# Altium project FMC_SDR_LFFE.PrjPcb (part 1 of 3)
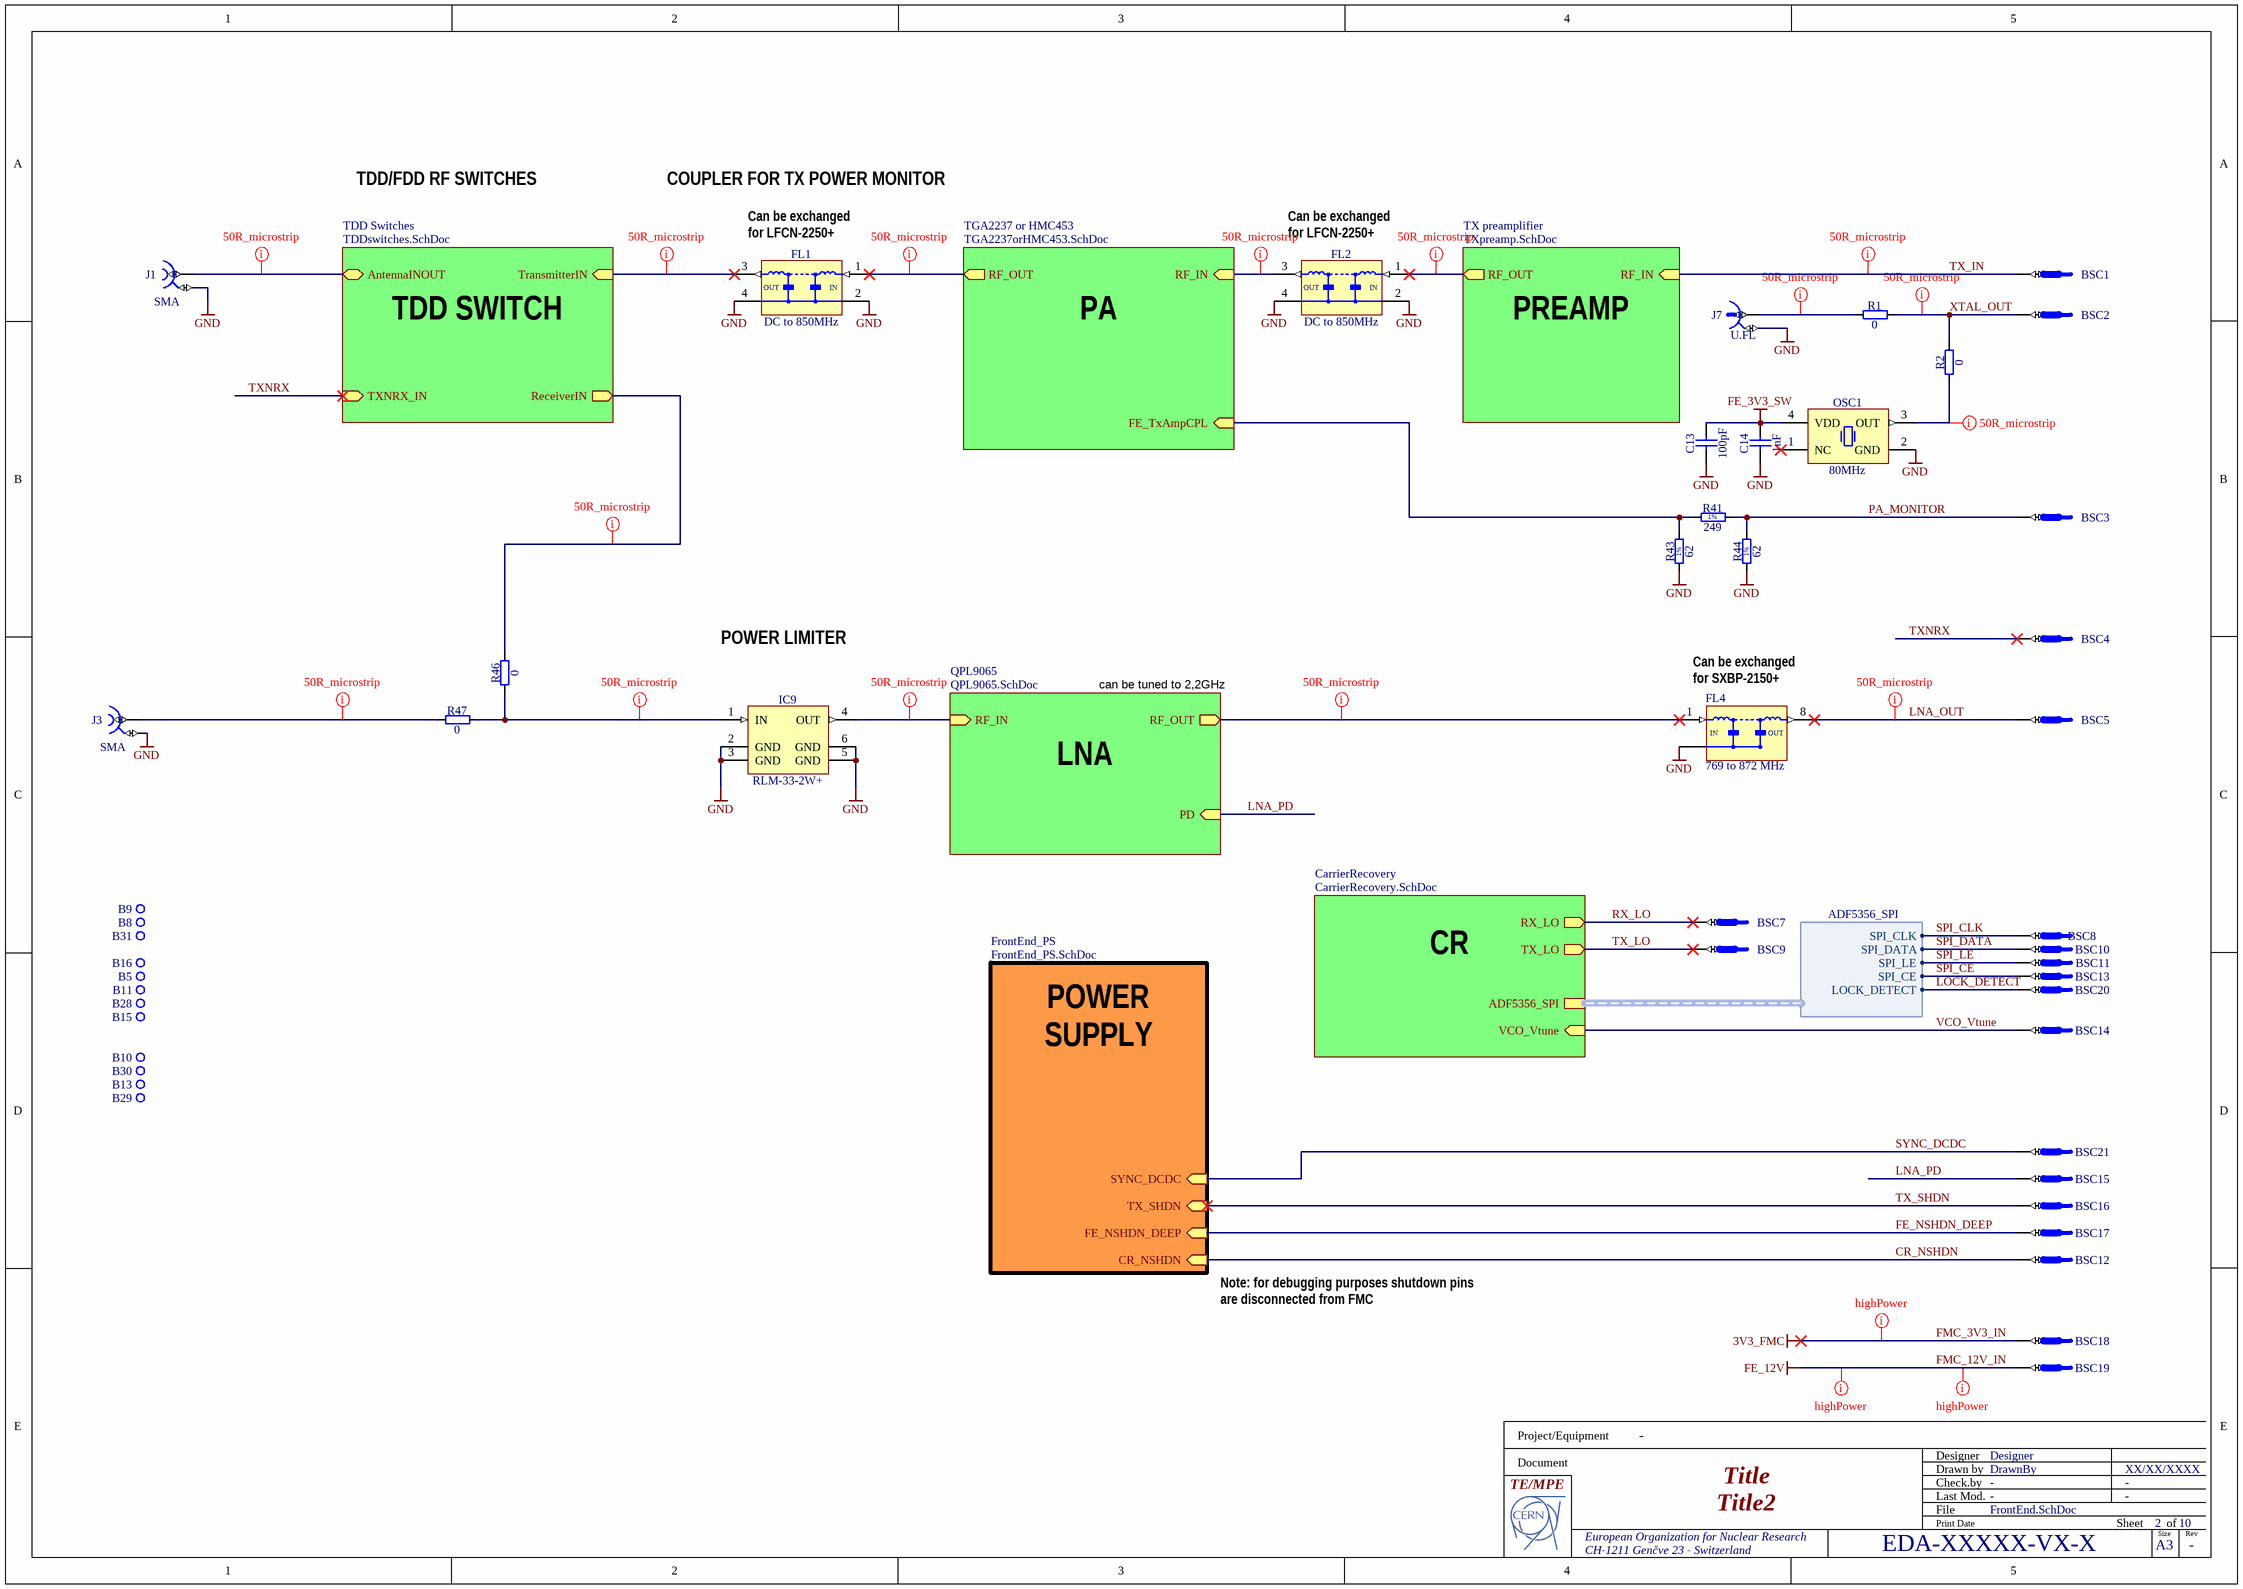
[diagram p0: FrontEnd.SchDoc]
10 sheets, 325 parts. Net scope: hierarchical (ports join the sheet entries above them; power ports are global).
Board file: FMC_SDR_LFFE.PcbDoc
Sheets:
  FrontEnd.SchDoc
    FrontEnd_PS = FrontEnd_PS.SchDoc
      BUCK1 = LTM8032_5V5.SchDoc
      BUCK2 = LTM8032_3V8.SchDoc
      BUCKBOOST = LTM8056.SchDoc
    QPL9065 = QPL9065.SchDoc
    TGA2237 or HMC453 = TGA2237orHMC453.SchDoc
    TX preamplifier = TXpreamp.SchDoc
    TDD Switches = TDDswitches.SchDoc
    CarrierRecovery = CarrierRecovery.SchDoc

## Sheet FrontEnd.SchDoc: Title
size 420 x 297 mm; CheckedBy: -; CompanyName: CERN; DrawnBy: DrawnBy; Organization: CERN; Address1: European Organization for Nuclear Research; Address2: CH-1211 Genčve 23 - Switzerland; DocumentNumber: 2; Revision: -; SheetNumber: 2; SheetTotal: 10; EDA_Number: EDA-XXXXX-VX-X; Projet: -; ModifiedBy: -; CreateDate: XX/XX/XXXX; CheckedDate: -; Title2: Title2; DivGrp: TE/MPE; Designer: Designer; ModifiedDate: -

### Parts
B5  Plated Hole  [MTG240_400]  (value not drawn)  (no BOM)
B8  Plated Hole  [MTG240_400]  (value not drawn)  (no BOM)
B9  Plated Hole  [MTG240_400]  (value not drawn)  (no BOM)
B10  Plated Hole  [MTG240_400]  (value not drawn)  (no BOM)
B11  Plated Hole  [MTG240_400]  (value not drawn)  (no BOM)
B13  Plated Hole  [MTG240_400]  (value not drawn)  (no BOM)
B15  Plated Hole  [MTG240_400]  (value not drawn)  (no BOM)
B16  Plated Hole  [MTG240_400]  (value not drawn)  (no BOM)
B28  Plated Hole  [MTG240_400]  (value not drawn)  (no BOM)
B29  Plated Hole  [MTG240_400]  (value not drawn)  (no BOM)
B30  Plated Hole  [MTG240_400]  (value not drawn)  (no BOM)
B31  Plated Hole  [MTG240_400]  (value not drawn)  (no BOM)
BSC1  06031206 Male  [PCB_CONN_0603M]  (value not drawn)
BSC2  06031206 Male  [PCB_CONN_0603M]  (value not drawn)
BSC3  06031206 Male  [PCB_CONN_0603M]  (value not drawn)
BSC4  06031206 Male  [PCB_CONN_0603M]  (value not drawn)
BSC5  06031206 Male  [PCB_CONN_0603M]  (value not drawn)
BSC7  06031206 Male  [PCB_CONN_0603M]  (value not drawn)
BSC8  06031206 Male  [PCB_CONN_0603M]  (value not drawn)
BSC9  06031206 Male  [PCB_CONN_0603M]  (value not drawn)
BSC10  06031206 Male  [PCB_CONN_0603M]  (value not drawn)
BSC11  06031206 Male  [PCB_CONN_0603M]  (value not drawn)
BSC12  06031206 Male  [PCB_CONN_0603M]  (value not drawn)
BSC13  06031206 Male  [PCB_CONN_0603M]  (value not drawn)
BSC14  06031206 Male  [PCB_CONN_0603M]  (value not drawn)
BSC15  06031206 Male  [PCB_CONN_0603M]  (value not drawn)
BSC16  06031206 Male  [PCB_CONN_0603M]  (value not drawn)
BSC17  06031206 Male  [PCB_CONN_0603M]  (value not drawn)
BSC18  1206 Male  [PCB_CONN_1206M]  (value not drawn)
BSC19  1206 Male  [PCB_CONN_1206M]  (value not drawn)
BSC20  06031206 Male  [PCB_CONN_0603M]  (value not drawn)
BSC21  06031206 Male  [PCB_CONN_0603M]  (value not drawn)
C13  100pF  [CAPC1005X55N]
C14  1nF  [CAPC1005X55N]
FL1  DC to 850MHz  [FIL_MINI-CIRCUITS_FV1206]
FL2  DC to 850MHz  [FIL_MINI-CIRCUITS_FV1206]
FL4  769 to 872 MHz  [SXBP-820+]
IC9  RLM-33-2W+  [MINI-CIRCUITS_TT1224]
J1  SMA  [TELEGARTNER_J01151A0451]
J3  SMA  [TELEGARTNER_J01151A0451]
J7  U.FL  [HIROSE_U.FL-R-SMT-1(10)]
OSC1  80MHz  [OSC_CRYSTEK_CCHD-575]
R1  0  [RESC1005X40N]
R2  0  [RESC1005X40N]
R41  249  [RESC1005X40N]
R43  62  [RESC1005X40N]
R44  62  [RESC1005X40N]
R46  0  [RESC1005X40N]
R47  0  [RESC1005X40N]

### Sub-sheets
CarrierRecovery = CarrierRecovery.SchDoc: RX_LO (out), TX_LO (out), ADF5356_SPI (harness ADF5356_SPI), VCO_Vtune (in)
FrontEnd_PS = FrontEnd_PS.SchDoc: TX_SHDN (in), FE_NSHDN_DEEP (in), CR_NSHDN (in), SYNC_DCDC (in)
QPL9065 = QPL9065.SchDoc: RF_OUT (out), RF_IN (in), PD (in)
TDD Switches = TDDswitches.SchDoc: AntennaINOUT (bidir), TransmitterIN (in), TXNRX_IN (in), ReceiverIN (out)
TGA2237 or HMC453 = TGA2237orHMC453.SchDoc: RF_OUT (out), RF_IN (in), FE_TxAmpCPL (in)
TX preamplifier = TXpreamp.SchDoc: RF_OUT (out), RF_IN (in)

### Harnesses
ADF5356_SPI: SPI_CLK, SPI_DATA, SPI_LE, SPI_CE, LOCK_DETECT

### Nets
FE_3V3_SW: C13.2 C14.2 OSC1.4(VDD)
FMC_3V3_IN: BSC18.1  [also labelled 3V3_FMC]
FMC_12V_IN: BSC19.1  [also labelled FE_12V]
GND: C13.1 C14.1 FL1.2(GND) FL1.4(GND) FL2.2(GND) FL2.4(GND) FL4.2,3,4,5,6,7(GND) IC9.2(GND) IC9.3(GND) IC9.5(GND) IC9.6(GND) J1.2 J3.2 J7.2 OSC1.2(GND) R43.1 R44.1
CR_NSHDN: BSC12.1 ; sheet FrontEnd_PS/CR_NSHDN
FE_NSHDN_DEEP: BSC17.1 ; sheet FrontEnd_PS/FE_NSHDN_DEEP
FE_TxAmpCPL: R41.1 R43.2 ; sheet TGA2237 or HMC453/FE_TxAmpCPL
LNA_OUT: BSC5.1 FL4.8(RFOUT)
LNA_PD: BSC15.1 ; sheet QPL9065/PD
LOCK_DETECT: BSC20.1 ; sheet CarrierRecovery/ADF5356_SPI.LOCK_DETECT
PA_MONITOR: BSC3.1 R41.2 R44.2
RX_LO: BSC7.1 ; sheet CarrierRecovery/RX_LO
SPI_CE: BSC13.1 ; sheet CarrierRecovery/ADF5356_SPI.SPI_CE  [project net 5356_SPI_CE]
SPI_CLK: BSC8.1 ; sheet CarrierRecovery/ADF5356_SPI.SPI_CLK  [project net 5356_SPI_CLK]
SPI_DATA: BSC10.1 ; sheet CarrierRecovery/ADF5356_SPI.SPI_DATA  [project net 5356_SPI_DATA]
SPI_LE: BSC11.1 ; sheet CarrierRecovery/ADF5356_SPI.SPI_LE  [project net 5356_SPI_LE]
SYNC_DCDC: BSC21.1 ; sheet FrontEnd_PS/SYNC_DCDC
TX_IN: BSC1.1 ; sheet TX preamplifier/RF_IN
TX_LO: BSC9.1 ; sheet CarrierRecovery/TX_LO
TX_SHDN: BSC16.1 ; sheet FrontEnd_PS/TX_SHDN
TXNRX: BSC4.1 ; sheet TDD Switches/TXNRX_IN
VCO_Vtune: BSC14.1 ; sheet CarrierRecovery/VCO_Vtune
XTAL_OUT: BSC2.1 R1.2 R2.2
NetC16_1: FL2.3(RFOUT) ; sheet TGA2237 or HMC453/RF_IN
NetC156_1: J1.1 ; sheet TDD Switches/AntennaINOUT
NetC157_2: FL1.3(RFOUT) ; sheet TDD Switches/TransmitterIN
NetC158_2: R46.2 ; sheet TDD Switches/ReceiverIN
NetC178_2: FL2.1(RFIN) ; sheet TX preamplifier/RF_OUT
NetFL1_1: FL1.1(RFIN) ; sheet TGA2237 or HMC453/RF_OUT
NetFL4_1: FL4.1(RFIN) ; sheet QPL9065/RF_OUT
NetIC9_1: IC9.1(IN) R46.1 R47.2
NetIC9_4: IC9.4(OUT) ; sheet QPL9065/RF_IN
NetJ3_1: J3.1 R47.1
NetJ7_1: J7.1 R1.1
NetOSC1_3: OSC1.3(OUT) R2.1

Not connected (* = marked no-connect by the designer): B5 1; B8 1; B9 1; B10 1; B11 1; B13 1; B15 1; B16 1; B28 1; B29 1; B30 1; B31 1; OSC1 1(NC)*

### Layout directives
net class 50R_class: LNA_OUT, NetC16_1, NetC156_1, NetC157_2, NetC158_2, NetC178_2, NetFL1_1, NetFL4_1, NetIC9_1, NetIC9_4, NetJ3_1, NetJ7_1, NetOSC1_3, TX_IN, XTAL_OUT
net class highPower: FMC_3V3_IN, FMC_12V_IN

### Notes on the sheet
- TDD/FDD RF SWITCHES
- COUPLER FOR TX POWER MONITOR
- (near FL1) Can be exchanged for LFCN-2250+
- (near FL2) Can be exchanged for LFCN-2250+
- TDD SWITCH
- PA
- PREAMP
- (near R41) -20dB
- POWER LIMITER
- can be tuned to 2,2GHz
- (near FL4) Can be exchanged for SXBP-2150+
- LNA
- CR
- POWER
  SUPPLY
- Note: for debugging purposes shutdown pins are disconnected from FMC
- Project/Equipment
- Document
- Designer
- Drawn by
- Check.by
- File
- Last Mod.
- Print Date
- Sheet
- Size
- A3
- of
- Rev
- (in symbol LFCN-900+) OUT; IN
- (in symbol R0402_62R_1%_0.0625W_100PPM) 1%
- (in symbol R0402_249R_1%_0.0625W_100PPM) 1%
- (in symbol SXBP-820+) IN; OUT

### Library data of the parts
B5 B8-B11 B13 B15 B16 B28-B31 = PLATED_HOLE2.4_PAD4.0: Single Terminal Socket; Part Description: Plated Through Hole: Hole Dia.=2.4mm Pad Dia.=4.0mm; Mounted: No; Table: Pads; Part Number: PLATED_HOLE2.4_PAD4.0; Component Type: Standard (No BOM); Pin Count: 1; Family: Plated Hole; Socket: No; SMD: No; Status: None; ComponentHeight: 0mm; Author: CERN DEM JMW; CreateDate: 2011-10-10; LatestRevisionDate: 2011-10-10; PackageDescription: Plated Through Hole: Hole Dia.=2.4mm Pad Dia.=4.0mm
BSC1-BSC5 BSC7-BSC17 BSC20 BSC21 = 0603_male_BoardSolderConnector: Part Description: Board connection - soldered 0603 jumper; PressFit: No; Pin Count: 1; Socket: No; SMD: Yes; Sense: No; Status: None; System: Connector
BSC18 BSC19 = 1206_male_BoardSolderConnector: Part Description: Board connection - soldered 1206 jumper; PressFit: No; Pin Count: 1; Socket: No; SMD: Yes; Sense: No; Status: None; System: Connector
C13 = CC0402_100PF_50V_5%_C0G: Non-polarised capacitor; Part Description: SMD Multilayer Chip Ceramic Capacitor; Manufacturer: GENERIC; Manufacturer1 Part Number: C0402C101J5GACTU; Voltage: 50V; TC: C0G/NP0; Tolerance: ±5%; Part Number: CC0402_100PF_50V_5%_C0G; Component Kind: Standard; Component Type: Standard; Pin Count: 2; Value: 100pF; Status: Preferred; Manufacturer Part Number: CC0402_100PF_50V_5%_C0G; Case: 0402; Mounted: Yes; Socket: No; SMD: Yes; Sense: No; Manufacturer1 Example: KEMET; Manufacturer1 ComponentHeight: 0.55mm; HelpURL: \\cern.ch\dfs\Applications\Altium\Datasheets\CC0805_C0G_KEMET_(Commercial Grade).pdf; Author: CERN DEM JLC; CreateDate: 03.12.2007; LatestRevisionDate: 22.04.2015
C14 = CC0402_1NF_50V_10%_X7R: Non-polarised capacitor; Part Description: SMD Multilayer Chip Ceramic Capacitor; Manufacturer: GENERIC; Manufacturer1 Part Number: 223858715623; Voltage: 50V; TC: X7R; Tolerance: ±10%; Part Number: CC0402_1NF_50V_10%_X7R; Component Kind: Standard; Component Type: Standard; Pin Count: 2; Value: 1nF; Status: Not Recommended; Manufacturer Part Number: CC0402_1NF_50V_10%_X7R; Case: 0402; Mounted: Yes; Socket: No; SMD: Yes; Sense: No; Manufacturer1 Example: PHYCOMP; Manufacturer1 ComponentHeight: 0.55mm; HelpURL: \\cern.ch\dfs\Applications\Altium\Datasheets\CC0402_X7R_PHYCOMP.pdf; Author: CERN DEM JLC; CreateDate: 03.12.2007; LatestRevisionDate: 03.12.2007
FL1 FL2 = LFCN-900+: LTCC Low Pass Filter, DC -850 MHz; Part Number: FIL_MINI-CIRCUITS_LFCN-1575+; Part Description: 50 Ohm Low Pass Filter; Manufacturer: MINI-CIRCUITS; Manufacturer Part Number: LFCN-1575+; Value: DC to 1575MHz; Component Kind: Standard; Component Type: Standard; Pin Count: 2; Status: None; Mounted: Yes; Socket: No; SMD: Yes; Sense: No; ComponentHeight: 0.94mm; HelpURL: \\cern.ch\dfs\Applications\Altium\Datasheets\FIL_MINI-CIRCUITS_LFCN-1575+.pdf; Author: CERN DEM JLC; CreateDate: 21.04.2014; LatestRevisionDate: 21.04.2015
FL4 = SXBP-820+
IC9 = RLM-33-2W+: 50 Ohm, 0.2 to 3000MHz, +12 to +33dBm Limiter; Part Description: 50 Ohms, 0.2 to 3000MHz, +12 to +33dBm Limiter; Manufacturer: MINI-CIRCUITS; PressFit: No; Bonding: No; Part Number: RLM-33-2W+; Component Kind: Standard; Component Type: Standard; Device: RLM-33-2W+; PackageDescription: MINI-CIRCUITS TT1224 Case, 6 pin, 6.35mm W X 7.87mm L; Manufacturer Part Number: RLM-33-2W+; Pin Count: 6; Mounted: Yes; Socket: No; SMD: Yes; Sense: No; ComponentHeight: 4.06mm; Author: CERN DEM JLC; HelpURL: \\cern.ch\dfs\Applications\Altium\Datasheets\RLM-33-2W+.pdf; CreateDate: 11.09.2013; LatestRevisionDate: 11.09.2013
J1 J3 = TELEGARTNER_J01151A0451: Part Description: SMA 50 ohms Edge Mount Bulkhead Jack Receptacle; PressFit: No; Part Number: TELEGARTNER_J01151A0451; Component Kind: Standard; Component Type: Standard; Pin Count: 2; Family: SMA; Mounted: Yes; Socket: No; SMD: No; Sense: No; Status: None; Manufacturer: TELEGARTNER; Manufacturer Part Number: J01151A0451; ComponentHeight: 7mm; HelpURL: \\cern.ch\dfs\Applications\Altium\Datasheets\TELEGARTNER_J01151A0451.pdf; Author: CERN DEM JLC; CreateDate: 27/10/2016; LatestRevisionDate: 27/10/2016
J7 = HIROSE_U.FL-R-SMT-1(10): Part Description: Up to 6GHz Ultra Small Surface Mount Male Coaxial Connectors U.FL Series; Manufacturer: HIROSE (HRS); PressFit: No; Part Number: HIROSE_U.FL-R-SMT-1(10); Component Kind: Standard; Component Type: Standard; Pin Count: 2; Family: U.FL; Mounted: Yes; Socket: No; SMD: Yes; Sense: No; Status: None; Manufacturer Part Number: U.FL-R-SMT-1(10); ComponentHeight: 1.25mm; HelpURL: \\cern.ch\dfs\Applications\Altium\Datasheets\HIROSE_U.FL-R-SMT-1(10).pdf; Author: CERN DEM JLC; CreateDate: 24.03.2010; LatestRevisionDate: 24.03.2010
OSC1 = OSC_80MHZ_CRYSTEK_CCHD-575X-20: Oscillator 4 pins 1=NC 2=GND 3=OUT 4=VDD; Part Description: 3.3V, ±20ppm, 15pF, -40..85°C, LVCMOS/LVTTL/HCMOS Surface Mount Clock Oscillator (SiT5003 Series); Manufacturer: CRYSTEK CRYSTAL; Manufacturer Part Number: CCHD-575X-20-80.000; PressFit: No; Bonding: No; Part Number: OSC_80MHZ_CRYSTEK_CCHD-575X-20; Component Kind: Standard; Component Type: Standard; PackageDescription: Oscillator, 5.08mm Pitch; 4 Pin, 5.08mm L X 7.5mm W X 2.5mm H, CCHD-575 Serie; Value: 80MHz; Pin Count: 4; Mounted: Yes; Socket: No; SMD: Yes; Sense: No; ComponentHeight: 2.5mm; HelpURL: \\cern.ch\dfs\Applications\Altium\Datasheets\OSC_CRYSTEK_CCHD-575.pdf; Author: CERN DEM JLC; CreateDate: 22.09.2011; LatestRevisionDate: 09.10.2012
R1 R2 R46 R47 = R0402_0R_JUMPER: Resistor; Part Description: 1A (0.05R Max DC Resistance) Zero Ohm Jumper; Manufacturer: GENERIC; Manufacturer1 Part Number: 232270591001L; PressFit: No; Part Number: R0402_0R_JUMPER; Component Kind: Standard; Component Type: Standard; Pin Count: 2; Value: 0; Status: Not Recommended; Manufacturer Part Number: R0402_0R_JUMPER; Case: 0402; Mounted: Yes; Sense: No; Socket: No; SMD: Yes; Manufacturer1 Example: YAGEO PHYCOMP; Manufacturer1 ComponentHeight: 0.4mm; HelpURL: \\cern.ch\dfs\Applications\Altium\Datasheets\R0402_Phycomp_RC0402.pdf; Author: CERN DEM JLC; CreateDate: 03.12.2007; LatestRevisionDate: 17.10.2012
R41 = R0402_249R_1%_0.0625W_100PPM: Resistor - 1%; Part Description: General Purpose Thick Film Chip Resistor; Manufacturer: GENERIC; Manufacturer1 Part Number: CRCW0402249RFKED; TC: ±100ppm/°C; PressFit: No; Part Number: R0402_249R_1%_0.0625W_100PPM; Component Kind: Standard; Component Type: Standard; Pin Count: 2; Value: 249; Status: None; Power: 0.0625W; Tolerance: ±1%; Manufacturer Part Number: R0402_249R_1%_0.0625W_100PPM; Case: 0402; Mounted: Yes; Sense: No; Socket: No; SMD: Yes; Manufacturer1 Example: VISHAY; Manufacturer1 ComponentHeight: 0.4mm; HelpURL: \\cern.ch\dfs\Applications\Altium\Datasheets\R0402_VISHAY_CRCW e3.pdf; Author: CERN DEM JLC; CreateDate: 04.11.2014; LatestRevisionDate: 04.11.2014
R43 R44 = R0402_62R_1%_0.0625W_100PPM: Resistor - 1%; Part Description: General Purpose Thick Film Chip Resistor; Manufacturer: GENERIC; Manufacturer1 Part Number: 232270676209L; TC: ±100ppm/°C; PressFit: No; Part Number: R0402_62R_1%_0.0625W_100PPM; Component Kind: Standard; Component Type: Standard; Pin Count: 2; Value: 62; Status: Not Recommended; Power: 0.0625W; Tolerance: ±1%; Manufacturer Part Number: R0402_62R_1%_0.0625W_100PPM; Case: 0402; Mounted: Yes; Sense: No; Socket: No; SMD: Yes; Manufacturer1 Example: YAGEO PHYCOMP; Manufacturer1 ComponentHeight: 0.4mm; HelpURL: \\cern.ch\dfs\Applications\Altium\Datasheets\R0402_Phycomp_RC0402.pdf; Author: CERN DEM JLC; CreateDate: 03.12.2007; LatestRevisionDate: 17.10.2012

## Sheet FrontEnd_PS.SchDoc: Title
size 420 x 297 mm; CheckedBy: -; CompanyName: CERN; DrawnBy: DrawnBy; Organization: CERN; Address1: European Organization for Nuclear Research; Address2: CH-1211 Genčve 23 - Switzerland; DocumentNumber: 3; Revision: -; SheetNumber: 3; SheetTotal: 10; EDA_Number: EDA-XXXXX-VX-X; Projet: -; ModifiedBy: -; CreateDate: XX/XX/XXXX; CheckedDate: -; Title2: Title2; DivGrp: TE/MPE; Designer: Designer; ModifiedDate: -
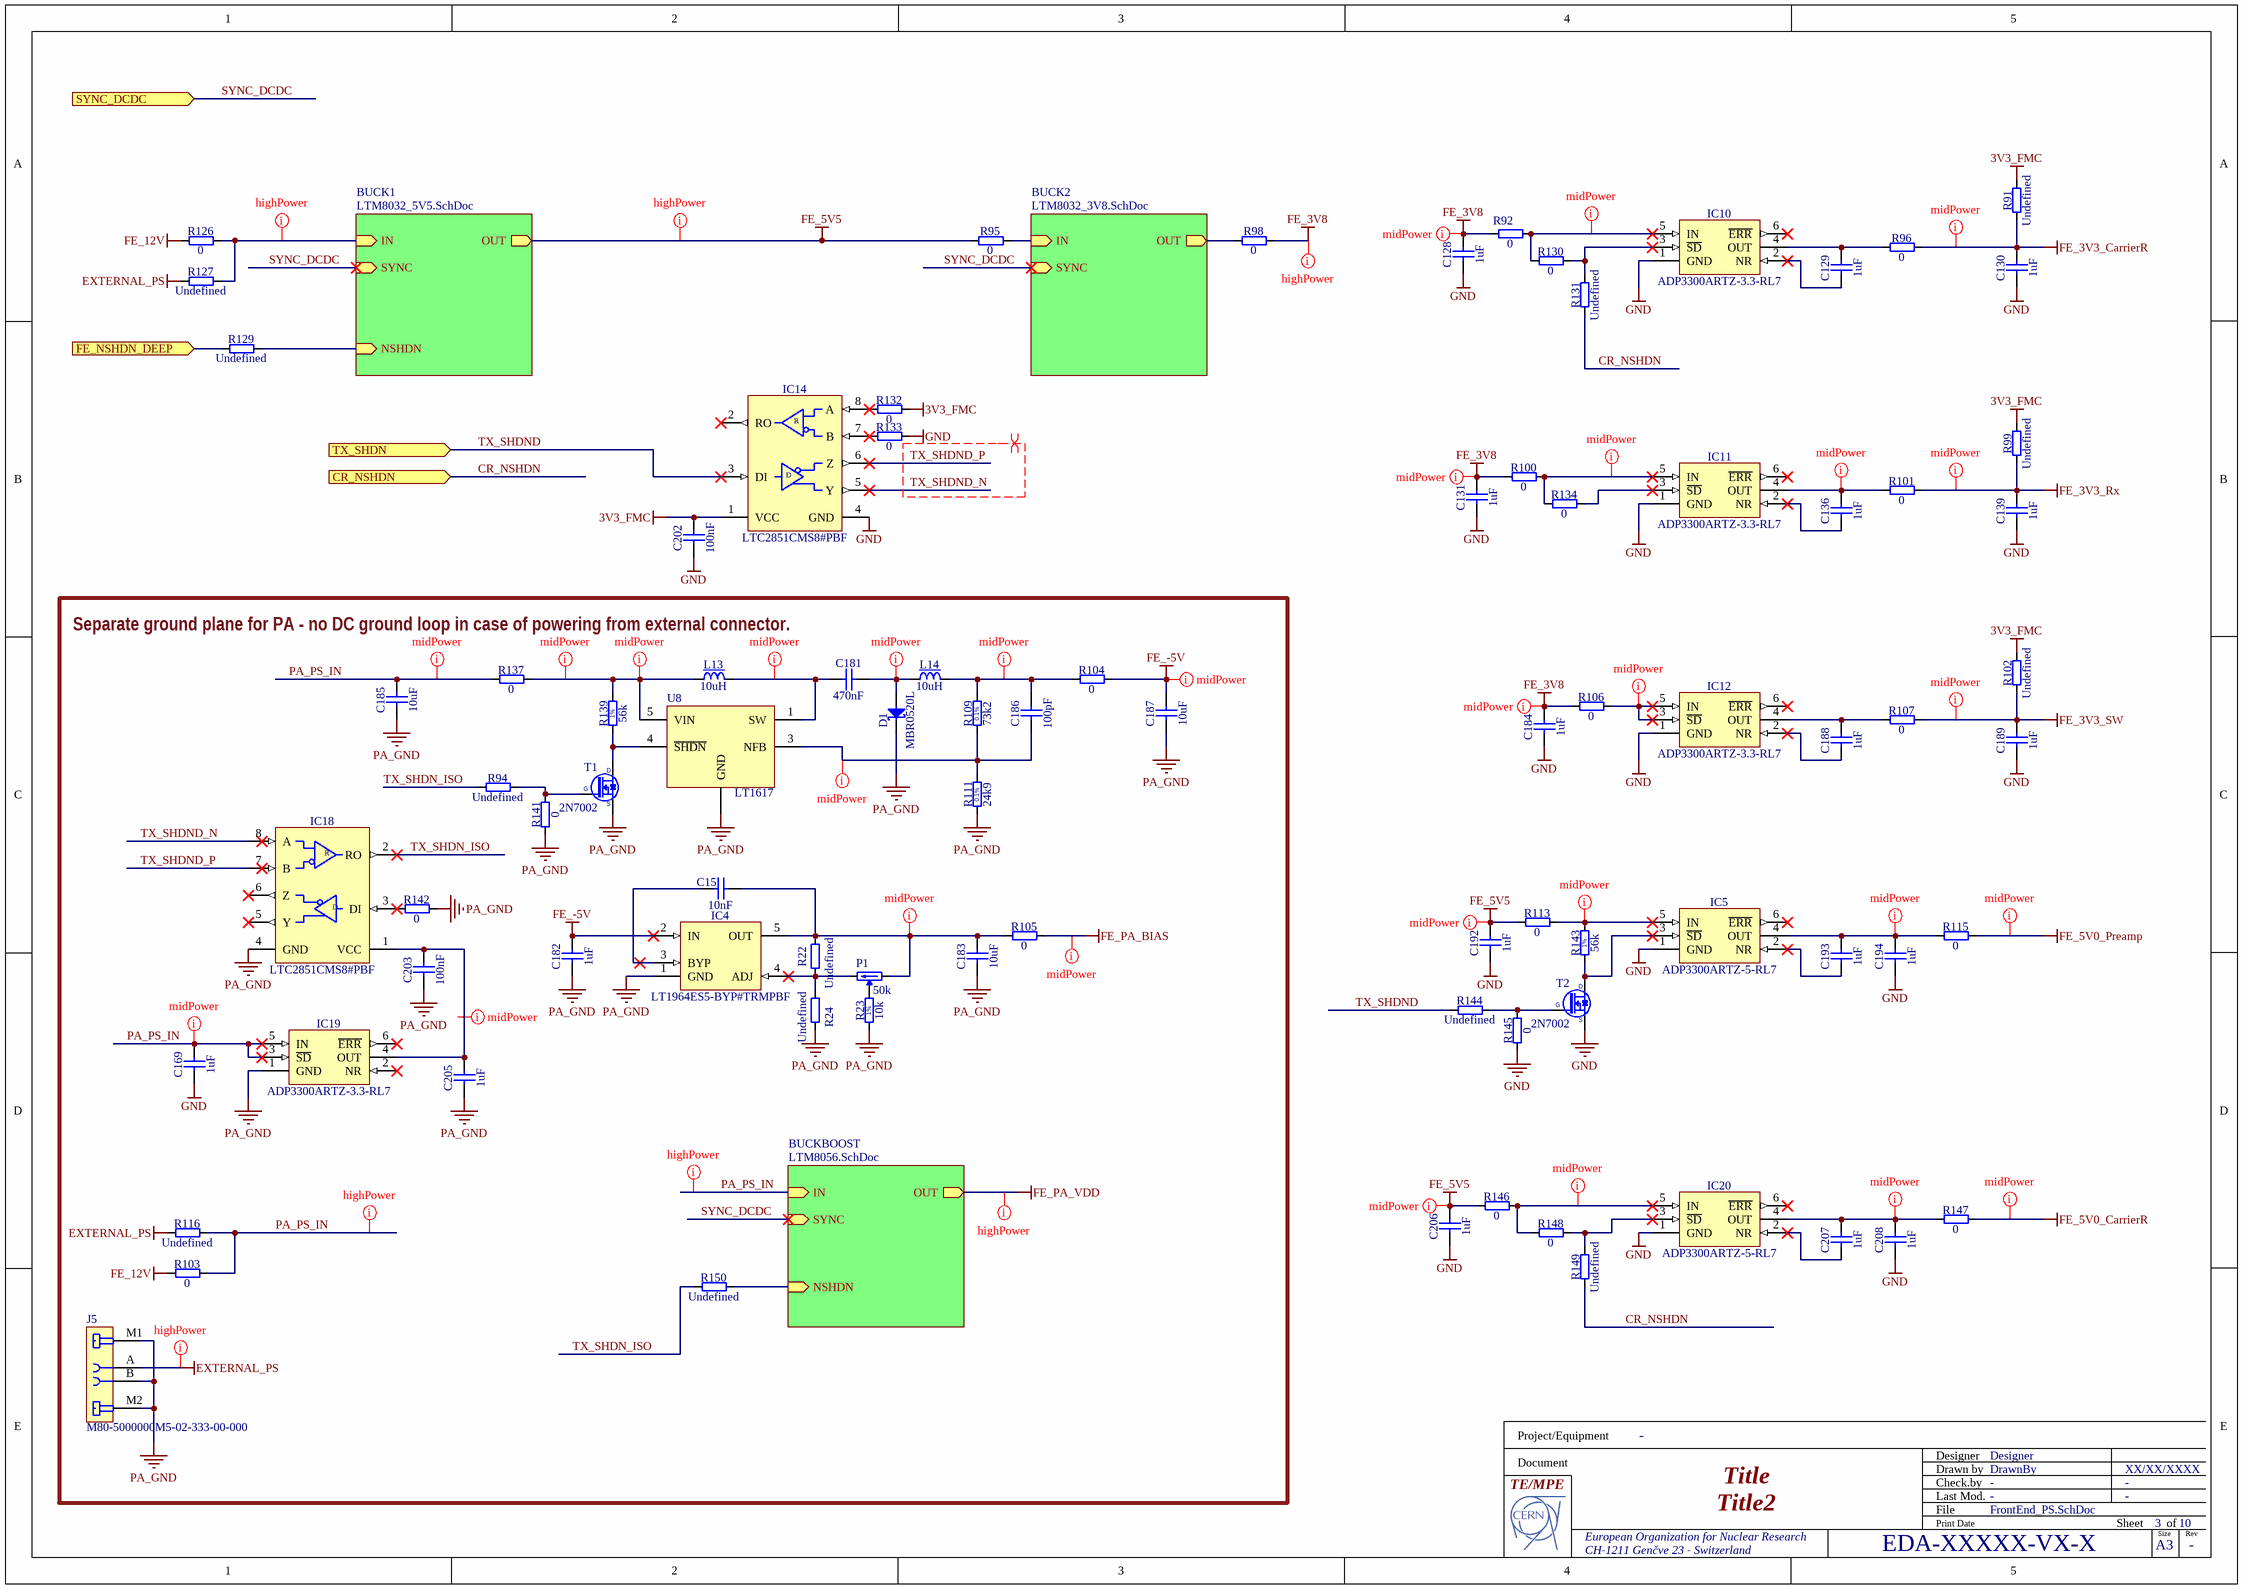
[diagram p1: FrontEnd_PS.SchDoc]

### Parts
C15  10nF  [CAPC1608X87N]
C128  1uF  [CAPC1608X87N]
C129  1uF  [CAPC1608X87N]
C130  1uF  [CAPC1608X87N]
C131  1uF  [CAPC1608X87N]
C136  1uF  [CAPC1608X87N]
C139  1uF  [CAPC1608X87N]
C169  1uF  [CAPC1608X87N]
C181  470nF  [CAPC2012X135N]
C182  1uF  [CAPC1608X87N]
C183  10uF  [CAPC2012X95N]
C184  1uF  [CAPC1608X87N]
C185  10uF  [CAPC2012X95N]
C186  100pF  [CAPC1005X55N]
C187  10uF  [CAPC2012X95N]
C188  1uF  [CAPC1608X87N]
C189  1uF  [CAPC1608X87N]
C192  1uF  [CAPC1608X87N]
C193  1uF  [CAPC1608X87N]
C194  1uF  [CAPC1608X87N]
C202  100nF  [CAPC1005X55N]
C203  100nF  [CAPC1005X55N]
C205  1uF  [CAPC1608X87N]
C206  1uF  [CAPC1608X87N]
C207  1uF  [CAPC1608X87N]
C208  1uF  [CAPC1608X87N]
D1  MBR0520L  [SOD3816X118N]
IC4  LT1964ES5-BYP#TRMPBF  [SOT95P280X100-5N]
IC5  ADP3300ARTZ-5-RL7  [SOT95P280X145-6N]
IC10  ADP3300ARTZ-3.3-RL7  [SOT95P280X145-6N]
IC11  ADP3300ARTZ-3.3-RL7  [SOT95P280X145-6N]
IC12  ADP3300ARTZ-3.3-RL7  [SOT95P280X145-6N]
IC14  LTC2851CMS8#PBF  [SOP65P490X110-8N]
IC18  LTC2851CMS8#PBF  [SOP65P490X110-8N]
IC19  ADP3300ARTZ-3.3-RL7  [SOT95P280X145-6N]
IC20  ADP3300ARTZ-5-RL7  [SOT95P280X145-6N]
J5  M80-5000000M5-02-333-00-000  [M80-5000000M5-02-333-00-000]
L13  10uH  [IND_MURATA_LQH32C]
L14  10uH  [IND_MURATA_LQH32C]
P1  50k  [TRIM_BOURNS_3223W]
R22  Undefined  [RESC1608X55N]
R23  10k  [RESC1005X40N]
R24  Undefined  [RESC1608X55N]
R91  Undefined  [RESC3216X65N]
R92  0  [RESC1608X55N]
R94  Undefined  [RESC1608X55N]
R95  0  [RESC1608X55N]
R96  0  [RESC1608X55N]
R98  0  [RESC1608X55N]
R99  Undefined  [RESC3216X65N]
R100  0  [RESC1608X55N]
R101  0  [RESC1608X55N]
R102  Undefined  [RESC3216X65N]
R103  0  [RESC1608X55N]
R104  0  [RESC1608X55N]
R105  0  [RESC1608X55N]
R106  0  [RESC1608X55N]
R107  0  [RESC1608X55N]
R109  73k2  [RESC1608X55N]
R111  24k9  [RESC1608X55N]
R113  0  [RESC1608X55N]
R115  0  [RESC1608X55N]
R116  Undefined  [RESC3216X65N]
R126  0  [RESC1608X55N]
R127  Undefined  [RESC3216X65N]
R129  Undefined  [RESC1608X55N]
R130  0  [RESC1608X55N]
R131  Undefined  [RESC1608X55N]
R132  0  [RESC1608X55N]
R133  0  [RESC1608X55N]
R134  0  [RESC1608X55N]
R137  0  [RESC1608X55N]
R139  56k  [RESC1005X40N]
R141  0  [RESC1608X55N]
R142  0  [RESC1608X55N]
R143  56k  [RESC1005X40N]
R144  Undefined  [RESC1608X55N]
R145  0  [RESC1608X55N]
R146  0  [RESC1608X55N]
R147  0  [RESC1608X55N]
R148  0  [RESC1608X55N]
R149  Undefined  [RESC1608X55N]
R150  Undefined  [RESC1608X55N]
T1  2N7002  [SOT95P240X130-3N]
T2  2N7002  [SOT95P240X130-3N]
U8  LT1617  [LT1617]

### Sub-sheets
BUCK1 = LTM8032_5V5.SchDoc: IN (in), SYNC (in), OUT (out), NSHDN (in)
BUCK2 = LTM8032_3V8.SchDoc: IN (in), SYNC (in), OUT (out)
BUCKBOOST = LTM8056.SchDoc: IN (in), SYNC (in), OUT (out), NSHDN (in)

### Ports
CR_NSHDN (in), FE_NSHDN_DEEP (in), SYNC_DCDC (in), TX_SHDN (in)

### Nets
3V3_FMC: C202.2 IC14.1(VCC) R91.2 R99.2 R102.2 R132.2  [project net FMC_3V3_IN]
EXTERNAL_PS: J5.A R116.1 R127.1
FE_3V3_CarrierR: C130.2 R91.1 R96.2
FE_3V3_Rx: C139.2 R99.1 R101.2
FE_3V3_SW: C189.2 R102.1 R107.2
FE_3V8: C128.2 C131.2 C184.2 R92.1 R98.2 R100.1 R106.1
FE_5V0_CarrierR: R147.2
FE_5V0_Preamp: R115.2
FE_5V5: C192.2 C206.2 R95.1 R113.1 R146.1 ; sheet BUCK1/OUT
FE_12V: R103.1 R126.1  [project net FMC_12V_IN]
FE_-5V: C182.2 C187.2 IC4.2(IN) R104.2
FE_PA_BIAS: R105.2
GND: C128.1 C130.1 C131.1 C139.1 C169.1 C184.1 C189.1 C192.1 C194.1 C202.1 C206.1 C208.1 IC5.1(GND) IC10.1(GND) IC11.1(GND) IC12.1(GND) IC14.4(GND) IC20.1(GND) R133.2 R145.1 T2.2(S)
PA_GND: C182.1 C183.1 C185.1 C187.1 C203.1 C205.1 D1.1(C) IC4.1(GND) IC18.4(GND) IC19.1(GND) J5.B J5.M1 J5.M2 R23.1 R24.1 R111.1 R141.1 R142.2 T1.2(S) U8.2(GND)
CR_NSHDN: R131.1 R149.1 ; port CR_NSHDN
FE_NSHDN_DEEP: R129.1 ; port FE_NSHDN_DEEP
PA_PS_IN: C169.2 C185.2 IC19.3(~{SD}) IC19.5(IN) R103.2 R116.2 R137.1 ; sheet BUCKBOOST/IN
SYNC_DCDC: port SYNC_DCDC, sheet BUCK1/SYNC, sheet BUCK2/SYNC, sheet BUCKBOOST/SYNC
TX_SHDN_ISO: IC18.2(RO) R94.1 R150.1
TX_SHDND: IC14.3(DI) R144.1 ; port TX_SHDN  [project net TX_SHDN]
TX_SHDND_N: IC14.5(Y) IC18.8(A)
TX_SHDND_P: IC14.6(Z) IC18.7(B)
NetC1_2: R95.2 ; sheet BUCK2/IN
NetC3_2: R98.1 ; sheet BUCK2/OUT
NetC10_2: R126.2 R127.2 ; sheet BUCK1/IN
NetC15_1: C15.1 IC4.3(BYP)
NetC15_2: C15.2 C183.2 IC4.5(OUT) P1.1(CCW) R22.2 R105.1
NetC129_1: C129.1 IC10.2(NR)
NetC129_2: C129.2 IC10.4(OUT) R96.1
NetC136_1: C136.1 IC11.2(NR)
NetC136_2: C136.2 IC11.4(OUT) R101.1
NetC181_1: C181.1 L13.2 U8.1(SW)
NetC181_2: C181.2 D1.2(A) L14.1
NetC186_1: C186.1 R109.1 R111.2 U8.3(NFB)
NetC186_2: C186.2 L14.2 R104.1 R109.2
NetC188_1: C188.1 IC12.2(NR)
NetC188_2: C188.2 IC12.4(OUT) R107.1
NetC193_1: C193.1 IC5.2(NR)
NetC193_2: C193.2 C194.2 IC5.4(OUT) R115.1
NetC203_2: C203.2 C205.2 IC18.1(VCC) IC19.4(OUT)
NetC207_1: C207.1 IC20.2(NR)
NetC207_2: C207.2 C208.2 IC20.4(OUT) R147.1
NetIC2_L4: R150.2 ; sheet BUCKBOOST/NSHDN
NetIC3_L5: R129.2 ; sheet BUCK1/NSHDN
NetIC4_4: IC4.4(ADJ) P1.3(CW) R22.1 R24.2
NetIC5_3: IC5.3(~{SD}) R143.1 T2.3(D)
NetIC5_5: IC5.5(IN) R113.2 R143.2
NetIC10_3: IC10.3(~{SD}) R130.2 R131.2
NetIC10_5: IC10.5(IN) R92.2 R130.1
NetIC11_3: IC11.3(~{SD}) R134.2
NetIC11_5: IC11.5(IN) R100.2 R134.1
NetIC12_3: IC12.3(~{SD}) IC12.5(IN) R106.2
NetIC14_7: IC14.7(B) R133.1
NetIC14_8: IC14.8(A) R132.1
NetIC18_3: IC18.3(DI) R142.1
NetIC20_3: IC20.3(~{SD}) R148.2 R149.2
NetIC20_5: IC20.5(IN) R146.2 R148.1
NetL13_1: L13.1 R137.2 R139.2 U8.5(VIN)
NetP1_2: P1.2(W) R23.2
NetR94_2: R94.2 R141.2 T1.1(G)
NetR139_1: R139.1 T1.3(D) U8.4(~{SHDN})
NetR144_2: R144.2 R145.2 T2.1(G)

Not connected (* = marked no-connect by the designer): IC5 6(~{ERR})*; IC10 6(~{ERR})*; IC11 6(~{ERR})*; IC12 6(~{ERR})*; IC14 2(RO)*; IC18 5(Y)* 6(Z)*; IC19 2(NR)* 6(~{ERR})*; IC20 6(~{ERR})*

### Layout directives
net class midPower: (no net found under the mark), FE_3V3_CarrierR, FE_3V3_Rx, FE_3V3_SW, FE_3V8, FE_5V0_CarrierR, FE_5V0_Preamp, FE_5V5, FE_-5V, FE_PA_BIAS, NetC15_2, NetC136_2, NetC181_1, NetC181_2, NetC186_1, NetC186_2, NetC193_2, NetC207_2, NetIC5_5, NetIC10_5, NetIC11_5, NetIC12_3, NetIC20_5, NetL13_1, PA_PS_IN
net class highPower: EXTERNAL_PS, FE_3V8, FE_5V5, FE_PA_VDD, NetC10_2, PA_PS_IN
differential pair; differential pair class 100R_diff: TX_SHDND_N, TX_SHDND_P

### Notes on the sheet
- Separate ground plane for PA - no DC ground loop in case of powering from external connector.
- (near R105) Starting from -4.5V
- Now 24V. Can be 5V.
- Project/Equipment
- Document
- Designer
- Drawn by
- Check.by
- File
- Last Mod.
- Print Date
- Sheet
- Size
- A3
- of
- Rev
- (in symbol LTC2851CMS8#PBF) R; D
- (in symbol R0402_10K_1%_0.0625W_100PPM) 1%
- (in symbol R0402_56K_1%_0.0625W_100PPM) 1%
- (in symbol R0603_24K9_0.1%_0.063W_10PPM) 0.1%
- (in symbol R0603_73K2_0.1%_0.063W_10PPM) 0.1%

### Library data of the parts
C15 = CC0603_10NF_50V_5%_C0G: Non-polarised capacitor; Part Description: SMD Multilayer Chip Ceramic Capacitor; Manufacturer: GENERIC; Manufacturer1 Part Number: C1608C0G1H103J080AA; Voltage: 50V; TC: C0G/NP0; Tolerance: ±5%; Part Number: CC0603_10NF_50V_5%_C0G; Component Kind: Standard; Component Type: Standard; Pin Count: 2; Value: 10nF; Status: Preferred; Manufacturer Part Number: CC0603_10NF_50V_5%_C0G; Case: 0603; Mounted: Yes; Socket: No; SMD: Yes; Sense: No; Manufacturer1 Example: TDK; Manufacturer1 ComponentHeight: 0.9mm; HelpURL: \\cern.ch\dfs\Applications\Altium\Datasheets\CC0603_C0G_TDK_C.pdf; Author: CERN DEM JLC; CreateDate: 10.12.2014; LatestRevisionDate: 10.12.2014
C128-C131 C136 C139 C169 C182 C184 C188 C189 C192-C194 C205-C208 = CC0603_1UF_25V_10%_X7R: Non-polarised capacitor; Part Description: SMD Multilayer Chip Ceramic Capacitor; Manufacturer: GENERIC; Manufacturer1 Part Number: GRM188R71E105KA12D; Voltage: 25V; TC: X7R; Tolerance: ±10%; Part Number: CC0603_1UF_25V_10%_X7R; Component Kind: Standard; Component Type: Standard; Pin Count: 2; Value: 1uF; Status: None; Manufacturer Part Number: CC0603_1UF_25V_10%_X7R; Case: 0603; Mounted: Yes; Socket: No; SMD: Yes; Sense: No; Manufacturer1 Example: MURATA; Manufacturer1 ComponentHeight: 0.9mm; HelpURL: \\cern.ch\dfs\Applications\Altium\Datasheets\CC0603_X7R_MURATA.pdf; Author: CERN DEM JLC; CreateDate: 18/01/2011; LatestRevisionDate: 18/01/2011
C181 = CC0805_470NF_16V_10%_X7R: Non-polarised capacitor; Part Description: SMD Multilayer Chip Ceramic Capacitor; Manufacturer: GENERIC; Manufacturer1 Part Number: CC0805KKX7R7BB474; Voltage: 16V; TC: X7R; Tolerance: ±10%; Part Number: CC0805_470NF_16V_10%_X7R; Component Kind: Standard; Component Type: Standard; Pin Count: 2; Value: 470nF; Status: Preferred; Manufacturer Part Number: CC0805_470NF_16V_10%_X7R; Case: 0805; Mounted: Yes; Socket: No; SMD: Yes; Sense: No; Manufacturer1 Example: YAGEO; Manufacturer1 ComponentHeight: 1.45mm; HelpURL: \\cern.ch\dfs\Applications\Altium\Datasheets\CC0805_X7R_YAGEO_HIGH CAPACITANCE_MAX50V.pdf; Author: CERN DEM JLC; CreateDate: 03.12.2007; LatestRevisionDate: 21.04.2015
C183 C185 C187 = CC0805_10UF_25V_10%_X5R: Non-polarised capacitor; Part Description: SMD Multilayer Chip Ceramic Capacitor; Manufacturer: GENERIC; Manufacturer1 Part Number: GRM219R61E106KA12D; Voltage: 25V; TC: X5R; Tolerance: ±10%; Part Number: CC0805_10UF_25V_10%_X5R; Component Kind: Standard; Component Type: Standard; Pin Count: 2; Value: 10uF; Status: Preferred; Manufacturer Part Number: CC0805_10UF_25V_10%_X5R; Case: 0805; Mounted: Yes; Socket: No; SMD: Yes; Sense: No; Manufacturer1 Example: MURATA; Manufacturer1 ComponentHeight: 0.95mm; HelpURL: \\cern.ch\dfs\Applications\Altium\Datasheets\CC0805_X5R_MURATA_GRM.pdf; Author: CERN DEM JLC; CreateDate: 25/10/2012; LatestRevisionDate: 06/09/2016
C186 = CC0402_100PF_50V_5%_C0G: as C13 on sheet FrontEnd; Part Number: CC0402_100PF_50V_5%_C0G; Component Kind: Standard; Component Type: Standard; Pin Count: 2; Value: 100pF; Status: Preferred; Manufacturer Part Number: CC0402_100PF_50V_5%_C0G; Case: 0402; Mounted: Yes; Socket: No; SMD: Yes; Sense: No; Manufacturer1 Example: KEMET; Manufacturer1 ComponentHeight: 0.55mm; HelpURL: \\cern.ch\dfs\Applications\Altium\Datasheets\CC0805_C0G_KEMET_(Commercial Grade).pdf; Author: CERN DEM JLC; CreateDate: 03.12.2007; LatestRevisionDate: 22.04.2015
C202 C203 = CC0402_100NF_16V_10%_X7R: Non-polarised capacitor; Part Description: SMD Multilayer Chip Ceramic Capacitor; Manufacturer: GENERIC; Manufacturer1 Part Number: GRM155R71C104KA88D; Voltage: 16V; TC: X7R; Tolerance: ±10%; Part Number: CC0402_100NF_16V_10%_X7R; Component Kind: Standard; Component Type: Standard; Pin Count: 2; Value: 100nF; Status: Not Recommended; Manufacturer Part Number: CC0402_100NF_16V_10%_X7R; Case: 0402; Mounted: Yes; Socket: No; SMD: Yes; Sense: No; Manufacturer1 Example: MURATA; Manufacturer1 ComponentHeight: 0.55mm; HelpURL: \\cern.ch\dfs\Applications\Altium\Datasheets\CC0402_X7R_MURATA_GRM.pdf; Author: CERN DEM JLC; CreateDate: 05.12.2013; LatestRevisionDate: 03.12.2007
D1 = MBR0520L: Schottky Diode; Part Description: Schottky Power Rectifier; Manufacturer: FAIRCHILD SEMICONDUCTOR; Voltage: 20V; Power: 0.5A; PressFit: No; Bonding: No; Part Number: MBR0520L; Component Kind: Standard; Component Type: Standard; Device: MBR0520L; PackageDescription: SOD Diode (SOD-123); 2.70mm W X 1.60mm L X 1.18mm H body, IPC Medium Density; Manufacturer Part Number: MBR0520L; Pin Count: 2; Case: SOD-123; Mounted: Yes; Socket: No; SMD: Yes; Sense: No; ComponentHeight: 1.18mm; HelpURL: \\cern.ch\dfs\Applications\Altium\Datasheets\MBR0520L.pdf; Author: CERN DEM JLC; CreateDate: 25.11.2009; LatestRevisionDate: 25.11.2009
IC4 = LT1964ES5-BYP#TRMPBF: 200mA, Low Noise, Low Dropout Negative Micropower Regulator; Part Description: -1.22V to -20V, 200mA, Low Noise, Low Dropout Negative Micropower Regulator; Manufacturer: LINEAR TECHNOLOGY; PressFit: No; Bonding: No; Part Number: LT1964ES5-BYP#TRMPBF; Component Kind: Standard; Component Type: Standard; Device: LT1964ES5-BYP#TRMPBF; PackageDescription: SOT23, 0.95mm pitch; 5 pin, 1.75mm W X 3.00mm L, IPC Medium Density; Manufacturer Part Number: LT1964ES5-BYP#TRMPBF; Pin Count: 5; Case: SOT23-5; Mounted: Yes; Socket: No; SMD: Yes; Sense: No; ComponentHeight: 1mm; HelpURL: \\cern.ch\dfs\Applications\Altium\Datasheets\LT1964ES5-BYP#TRMPBF.pdf; Author: CERN DEM MR; CreateDate: 17.02.2016; LatestRevisionDate: 17.02.2016
IC5 IC20 = ADP3300ARTZ-5-RL7: High Accuracy anyCAP® 50 mA Low Dropout Linear Regulator; Part Description: 5V High Accuracy anyCAP® 50 Ma Low Dropout Linear Regulator; Manufacturer: ANALOG DEVICES; PressFit: No; Bonding: No; Part Number: ADP3300ARTZ-5-RL7; Component Kind: Standard; Component Type: Standard; Device: ADP3300ARTZ-5-RL7; PackageDescription: SOT23, 0.95mm pitch; 6 pin, 1.6mm W X 2.9mm L X 1.45mm H body, IPC Medium Density; Manufacturer Part Number: ADP3300ARTZ-5-RL7; Pin Count: 6; Case: SOT23-6; Mounted: Yes; Socket: No; SMD: Yes; Sense: No; ComponentHeight: 1.45mm; HelpURL: \\cern.ch\dfs\Applications\Altium\Datasheets\ADP3300ARTZ-5-RL7.pdf; Author: CERN DEM JLC; CreateDate: 30.11.2011; LatestRevisionDate: 30.11.2011
IC10-IC12 IC19 = ADP3300ARTZ-3.3-RL7: High Accuracy anyCAP® 50 mA Low Dropout Linear Regulator; Part Description: 3.3V High Accuracy anyCAP® 50 Ma Low Dropout Linear Regulator; Manufacturer: ANALOG DEVICES; PressFit: No; Bonding: No; Part Number: ADP3300ARTZ-3.3-RL7; Component Kind: Standard; Component Type: Standard; Device: ADP3300ARTZ-3.3-RL7; PackageDescription: SOT23, 0.95mm pitch; 6 pin, 1.6mm W X 2.9mm L X 1.45mm H body, IPC Medium Density; Manufacturer Part Number: ADP3300ARTZ-3.3-RL7; Pin Count: 6; Case: SOT23-6; Mounted: Yes; Socket: No; SMD: Yes; Sense: No; ComponentHeight: 1.45mm; HelpURL: \\cern.ch\dfs\Applications\Altium\Datasheets\ADP3300ARTZ-3.3-RL7.pdf; Author: CERN DEM JLC; CreateDate: 30.11.2011; LatestRevisionDate: 30.11.2011
IC14 IC18 = LTC2851CMS8#PBF: 3.3V 20Mbps RS485/RS422 Transceivers; Manufacturer: LINEAR TECHNOLOGY; PressFit: No; Bonding: No; Part Number: LTC2851CMS8#PBF; Component Kind: Standard; Component Type: Standard; Device: LTC2851CMS8#PBF; PackageDescription: SOP, 0.65mm pitch; 8 pin, 3.00mm W X 3.00mm L X 1.10mm H body, IPC Medium Density; Part Description: 3.3V 20Mbps RS485/RS422 Transceivers; Manufacturer Part Number: LTC2851CMS8#PBF; Pin Count: 8; Case: MSOP8; Mounted: Yes; Socket: No; SMD: Yes; Sense: No; ComponentHeight: 1.1mm; HelpURL: \\cern.ch\dfs\Applications\Altium\Datasheets\LTC2851CMS8#PBF.pdf; Author: CERN DEM JLC; CreateDate: 14.12.2010; LatestRevisionDate: 14.12.2010
J5 = CON_M80-5000000M5-02-333-00-000: 2pin (2 power), THT socket with M2 jackscrews; Manufacturer: Harwin; Part Number: M80-5L10405M5-02-333-00-000; Bonding: No; ComponentHeigth: 6.05mm; PressFit: No; Case: M80-5000000M5-02-333-00-000; Component Kind: Standard; Component Type: Standard; CreateDate: 2018-06-18; Device: M80-5000000M5-02-333-00-000; HelpURL: https://www.harwin.com/products/M80-5000000M5-02-333-00-000/; LatestRevisionDate: 2018-06-18; Manufacturer Part Number: M80-5000000M5-02-333-00-000; Mounted: Yes; PackageDescription: H=6.05mm, W=18mm, D=8.6mm; Part Description: 2pin (2 power), THT socket with M2 jackscrews; Pin Count: 6; Sense: No; SMD: No; Socket: No; Value: *
L13 L14 = IND_10UH_10%_MURATA_LQH32CN100K33L: Inductor With Core; Part Description: Chip Inductor (Chip Coil) for Choke Wire Wound Type; Manufacturer: MURATA; Power: 450mA; Resistance: 0.3R; Tolerance: ±10%; Part Number: IND_10UH_10%_MURATA_LQH32CN100K33L; Component Kind: Standard; Component Type: Standard; Pin Count: 2; Value: 10uH; Status: None; Manufacturer Part Number: LQH32CN100K33L; Mounted: Yes; Socket: No; SMD: Yes; Sense: No; ComponentHeight: 2.2mm; HelpURL: \\cern.ch\dfs\Applications\Altium\Datasheets\IND_MURATA_LQH32CN_33.pdf; Author: CERN DEM JLC; CreateDate: 06.04.2009; LatestRevisionDate: 04.07.2018
P1 = TRIM_11T_50K_BOURNS_3223W-1-503E: Trimming Potentiometer; Part Description: 11 Turns SMD Trimpot® Trimming Potentiometer (Top Adjust); Manufacturer: BOURNS; Power: 0.125W; TC: ±100ppm/°C; Tolerance: ±20%; PressFit: No; Part Number: TRIM_11T_50K_BOURNS_3223W-1-503E; Component Kind: Standard; Component Type: Standard; Pin Count: 3; Value: 50k; Manufacturer Part Number: 3223W-1-503E; Case: 3223W; Mounted: Yes; Socket: No; SMD: Yes; Sense: No; ComponentHeight: 4.16mm; HelpURL: \\cern.ch\dfs\Applications\Altium\Datasheets\TRIM_BOURNS_3223W.pdf; Author: CERN DEM JLC; CreateDate: 31.03.2011; LatestRevisionDate: 18.12.2012
R22 R24 R94 R129 R131 R144 R149 R150 = R0603_NO-VALUE: Resistor; Part Description: Reserved Footprint For a 0603 (1608) Chip Resistor; PressFit: No; Mounted: No; Part Number: R0603_NO-VALUE; Component Kind: Standard; Component Type: Standard; Pin Count: 2; Value: Undefined; Status: None; Manufacturer: Undefined; Manufacturer Part Number: R0603_NO-VALUE; Case: 0603; Sense: No; Socket: No; SMD: Yes; Manufacturer1 Example: Undefined; Manufacturer1 Part Number: Undefined; Manufacturer1 ComponentHeight: Undefined; HelpURL: Undefined; Author: CERN DEM JLC; CreateDate: 03.12.2007; LatestRevisionDate: 13.03.2008
R23 = R0402_10K_1%_0.0625W_100PPM: Resistor - 1%; Part Description: General Purpose Thick Film Chip Resistor; Manufacturer: GENERIC; Manufacturer1 Part Number: 232270671003L; TC: ±100ppm/°C; PressFit: No; Part Number: R0402_10K_1%_0.0625W_100PPM; Component Kind: Standard; Component Type: Standard; Pin Count: 2; Value: 10k; Status: Not Recommended; Power: 0.0625W; Tolerance: ±1%; Manufacturer Part Number: R0402_10K_1%_0.0625W_100PPM; Case: 0402; Mounted: Yes; Sense: No; Socket: No; SMD: Yes; Manufacturer1 Example: YAGEO PHYCOMP; Manufacturer1 ComponentHeight: 0.4mm; HelpURL: \\cern.ch\dfs\Applications\Altium\Datasheets\R0402_Phycomp_RC0402.pdf; Author: CERN DEM JLC; CreateDate: 03.12.2007; LatestRevisionDate: 17.10.2012
R91 R99 R102 R116 R127 = R1206_NO-VALUE: Resistor; Part Description: Reserved Footprint For a 1206 (3216) Chip Resistor; PressFit: No; Mounted: No; Part Number: R1206_NO-VALUE; Component Kind: Standard; Component Type: Standard; Pin Count: 2; Value: Undefined; Status: None; Manufacturer: Undefined; Manufacturer Part Number: R1206_NO-VALUE; Case: 1206; Sense: No; Socket: No; SMD: Yes; Manufacturer1 Example: Undefined; Manufacturer1 Part Number: Undefined; Manufacturer1 ComponentHeight: 0.65mm; HelpURL: Undefined; Author: CERN DEM JLC; CreateDate: 03.12.2007; LatestRevisionDate: 13.03.2008
R92 R95 R96 R98 R100 R101 R103-R107 R113 R115 R126 R130 R132-R134 R137 R141 R142 R145-R148 = R0603_0R_JUMPER: Resistor; Part Description: 1A (0.05R Max DC Resistance) Zero Ohm Jumper; Manufacturer: GENERIC; Manufacturer1 Part Number: NRC06Z0; PressFit: No; Part Number: R0603_0R_JUMPER; Component Kind: Standard; Component Type: Standard; Pin Count: 2; Value: 0; Status: Preferred; Manufacturer Part Number: R0603_0R_JUMPER; Case: 0603; Mounted: Yes; Sense: No; Socket: No; SMD: Yes; Manufacturer1 Example: NIC COMPONENT; Manufacturer1 ComponentHeight: 0.55mm; HelpURL: \\cern.ch\dfs\Applications\Altium\Datasheets\R0603_NIC_NRC.pdf; Author: CERN DEM JLC; CreateDate: 03.12.2007; LatestRevisionDate: 13.03.2008
R109 = R0603_73K2_0.1%_0.063W_10PPM: Resistor - 0.1%; Part Description: Thin Film Chip Resistor; Manufacturer: GENERIC; Manufacturer1 Part Number: RN73C1J73K2BTDF; Power: 0.063W; TC: ±10ppm; PressFit: No; Part Number: R0603_73K2_0.1%_0.063W_10PPM; Component Kind: Standard; Component Type: Standard; Pin Count: 2; Value: 73k2; Status: Not Recommended; Tolerance: ±0.1%; Manufacturer Part Number: R0603_73K2_0.1%_0.063W_10PPM; Case: 0603; Mounted: Yes; Sense: No; Socket: No; SMD: Yes; Manufacturer1 Example: TYCO HOLSWORTHY; Manufacturer1 ComponentHeight: 0.5mm; HelpURL: \\cern.ch\dfs\Applications\Altium\Datasheets\R0603_Tyco_RN73.pdf; Author: CERN DEM JLC; CreateDate: 03.12.2007; LatestRevisionDate: 13.03.2008
R111 = R0603_24K9_0.1%_0.063W_10PPM: Resistor - 0.1%; Part Description: Thin Film Chip Resistor; Manufacturer: GENERIC; Manufacturer1 Part Number: RN73C1J24K9BTDF; Power: 0.063W; TC: ±10ppm; PressFit: No; Part Number: R0603_24K9_0.1%_0.063W_10PPM; Component Kind: Standard; Component Type: Standard; Pin Count: 2; Value: 24k9; Status: Not Recommended; Tolerance: ±0.1%; Manufacturer Part Number: R0603_24K9_0.1%_0.063W_10PPM; Case: 0603; Mounted: Yes; Sense: No; Socket: No; SMD: Yes; Manufacturer1 Example: TYCO HOLSWORTHY; Manufacturer1 ComponentHeight: 0.5mm; HelpURL: \\cern.ch\dfs\Applications\Altium\Datasheets\R0603_Tyco_RN73.pdf; Author: CERN DEM JLC; CreateDate: 03.12.2007; LatestRevisionDate: 13.03.2008
R139 R143 = R0402_56K_1%_0.0625W_100PPM: Resistor - 1%; Part Description: General Purpose Thick Film Chip Resistor; Manufacturer: GENERIC; Manufacturer1 Part Number: 232270675603L; TC: ±100ppm/°C; PressFit: No; Part Number: R0402_56K_1%_0.0625W_100PPM; Component Kind: Standard; Component Type: Standard; Pin Count: 2; Value: 56k; Status: Not Recommended; Power: 0.0625W; Tolerance: ±1%; Manufacturer Part Number: R0402_56K_1%_0.0625W_100PPM; Case: 0402; Mounted: Yes; Sense: No; Socket: No; SMD: Yes; Manufacturer1 Example: YAGEO PHYCOMP; Manufacturer1 ComponentHeight: 0.4mm; HelpURL: \\cern.ch\dfs\Applications\Altium\Datasheets\R0402_Phycomp_RC0402.pdf; Author: CERN DEM JLC; CreateDate: 03.12.2007; LatestRevisionDate: 17.10.2012
T1 T2 = 2N7002: N-CHANNEL MOSFET WITH DIODE; Part Description: 60V 280mA N-Channel Enhancement Mode Field Effect Transistor (FET); Manufacturer: FAIRCHILD SEMICONDUCTOR; PressFit: No; Bonding: No; Part Number: 2N7002; Component Kind: Standard; Component Type: Standard; Device: 2N7002; PackageDescription: SOT23 3-Leads, Pitch 0.95mm - Body 1.3x2.9mm, IPC Medium Density; Manufacturer Part Number: 2N7002; Pin Count: 3; Case: SOT23-3; Mounted: Yes; Socket: No; SMD: Yes; Sense: No; ComponentHeight: 1.3mm; HelpURL: \\cern.ch\dfs\Applications\Altium\Datasheets\2N7002.pdf; Author: CERN DEM JLC; CreateDate: 20.08.2008; LatestRevisionDate: 07.04.2009

## Sheet LTM8032_5V5.SchDoc
size A3; DocumentNumber: 8; SheetNumber: 8; SheetTotal: 10
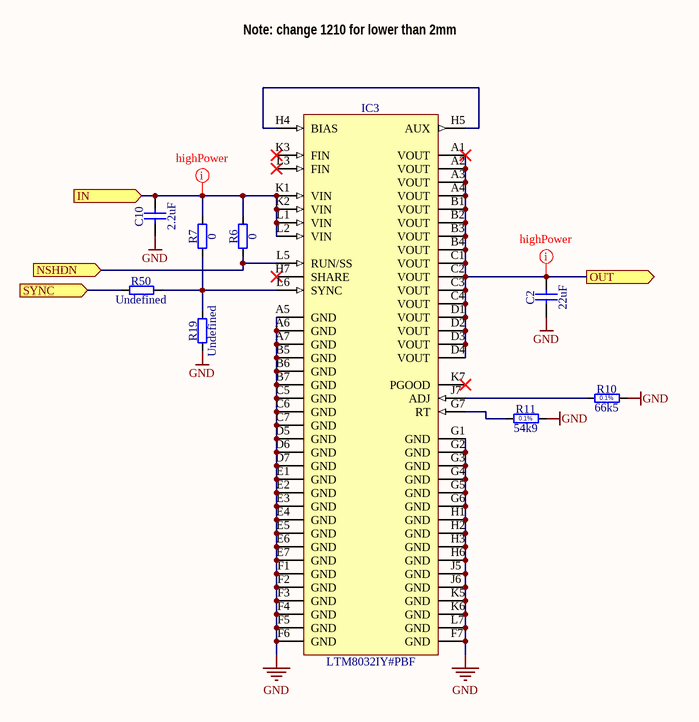
[diagram p2: LTM8032_5V5.SchDoc]

### Parts
C2  22uF  [CAPC3216X180N]
C10  2.2uF  [CAPC2012X140N]
IC3  LTM8032IY#PBF  [BGA71C127P7X11_900X1500X362]
R6  0  [RESC1608X55N]
R7  0  [RESC1608X55N]
R10  66k5  [RESC1608X55N]
R11  54k9  [RESC1608X55N]
R19  Undefined  [RESC1608X55N]
R50  Undefined  [RESC1608X55N]

### Ports
IN (in), NSHDN (in), OUT (out), SYNC (in)

### Nets
FE_5V5: C2.2 IC3.A1(VOUT) IC3.A2(VOUT) IC3.A3(VOUT) IC3.A4(VOUT) IC3.B1(VOUT) IC3.B2(VOUT) IC3.B3(VOUT) IC3.B4(VOUT) IC3.C1(VOUT) IC3.C2(VOUT) IC3.C3(VOUT) IC3.C4(VOUT) IC3.D1(VOUT) IC3.D2(VOUT) IC3.D3(VOUT) IC3.D4(VOUT) ; port OUT
GND: C2.1 C10.1 IC3.A5(GND) IC3.A6(GND) IC3.A7(GND) IC3.B5(GND) IC3.B6(GND) IC3.B7(GND) IC3.C5(GND) IC3.C6(GND) IC3.C7(GND) IC3.D5(GND) IC3.D6(GND) IC3.D7(GND) IC3.E1(GND) IC3.E2(GND) IC3.E3(GND) IC3.E4(GND) IC3.E5(GND) IC3.E6(GND) IC3.E7(GND) IC3.F1(GND) IC3.F2(GND) IC3.F3(GND) IC3.F4(GND) IC3.F5(GND) IC3.F6(GND) IC3.F7(GND) IC3.G1(GND) IC3.G2(GND) IC3.G3(GND) IC3.G4(GND) IC3.G5(GND) IC3.G6(GND) IC3.H1(GND) IC3.H2(GND) IC3.H3(GND) IC3.H6(GND) IC3.J5(GND) IC3.J6(GND) IC3.K5(GND) IC3.K6(GND) IC3.L7(GND) R10.2 R11.2 R19.1
SYNC_DCDC: R50.1 ; port SYNC
NetC10_2: C10.2 IC3.K1(VIN) IC3.K2(VIN) IC3.L1(VIN) IC3.L2(VIN) R6.2 R7.2 ; port IN
NetIC3_G7: IC3.G7(RT) R11.1
NetIC3_H4: IC3.H4(BIAS) IC3.H5(AUX)
NetIC3_J7: IC3.J7(ADJ) R10.1
NetIC3_L5: IC3.L5(RUN/SS) R6.1 ; port NSHDN
NetIC3_L6: IC3.L6(SYNC) R7.1 R19.2 R50.2

Not connected (* = marked no-connect by the designer): IC3 H7(SHARE)* K3(FIN)* K7(PGOOD)* L3(FIN)*

### Layout directives
net class highPower: FE_5V5, NetC10_2

### Notes on the sheet
- Note: change 1210 for lower than 2mm
- (in symbol R0603_54K9_0.1%_0.063W_10PPM) 0.1%
- (in symbol R0603_66K5_0.1%_0.063W_10PPM) 0.1%

### Library data of the parts
C2 = CC1206_22UF_10V_10%_X7R: Non-polarised capacitor; Part Description: SMD Multilayer Chip Ceramic Capacitor; Manufacturer: GENERIC; Manufacturer1 Part Number: GRM31CR71A226KE15L; Voltage: 10V; TC: X7R; Tolerance: ±10%; Part Number: CC1206_22UF_10V_10%_X7R; Component Kind: Standard; Component Type: Standard; Pin Count: 2; Value: 22uF; Status: Preferred; Manufacturer Part Number: CC1206_22UF_10V_10%_X7R; Case: 1206; Mounted: Yes; Socket: No; SMD: Yes; Sense: No; Manufacturer1 Example: MURATA; Manufacturer1 ComponentHeight: 1.8mm; HelpURL: \\cern.ch\dfs\Applications\Altium\Datasheets\CC1206_X7R_MURATA_GRM-HI-CAP.pdf; Author: CERN DEM JLC; CreateDate: 08.06.2010; LatestRevisionDate: 08.06.2010
C10 = CC0805_2.2UF_50V_10%_X7R: Non-polarised capacitor; Part Description: SMD Multilayer Chip Ceramic Capacitor; Manufacturer: GENERIC; Manufacturer1 Part Number: GRM21BR61H225KA73L; Voltage: 50V; TC: X7R; Tolerance: ±10%; Part Number: CC0805_2.2UF_50V_10%_X7R; Component Kind: Standard; Component Type: Standard; Pin Count: 2; Value: 2.2uF; Status: Preferred; Manufacturer Part Number: CC0805_2.2UF_50V_10%_X7R; Case: 0805; Mounted: Yes; Socket: No; SMD: Yes; Sense: No; Manufacturer1 Example: MURATA; Manufacturer1 ComponentHeight: 1.40mm; HelpURL: \\cern.ch\dfs\Applications\Altium\Datasheets\CC0805_X7R_MURATA_GRM.pdf; Author: CERN DEM JLC; CreateDate: 18.08.2014; LatestRevisionDate: 18.08.2014
IC3 = LTM8032IY#PBF: 3V-36V To 0.8V-10V, Iout 2A Ultralow Noise EMC Compliant DC/DC uModule; Part Description: 3V-36V To 0.8V-10V, Iout 2A, Ultralow Noise EMC Compliant DC-DC uModule; Manufacturer: LINEAR TECHNOLOGY; PressFit: No; Bonding: No; Part Number: LTM8032IY#PBF; Component Kind: Standard; Component Type: Standard; Device: LTM8032IY#PBF; PackageDescription: BGA, 1.27mm pitch, rect., 71 pin, 7 columns X 11 rows, 9mm X 15mm X 3.62mm H; Manufacturer Part Number: LTM8032IY#PBF; Pin Count: 71; Case: BGA71; Mounted: Yes; Socket: No; SMD: Yes; Sense: No; ComponentHeight: 3.62mm; HelpURL: \\cern.ch\dfs\Applications\Altium\Datasheets\LTM8032IY#PBF.pdf; Author: CERN DEM BC; CreateDate: 17.12.2018; LatestRevisionDate: 17.12.2018
R6 R7 = R0603_0R_JUMPER: as R92 on sheet FrontEnd_PS; Part Number: R0603_0R_JUMPER; Component Kind: Standard; Component Type: Standard; Pin Count: 2; Value: 0; Status: Preferred; Manufacturer Part Number: R0603_0R_JUMPER; Case: 0603; Mounted: Yes; Sense: No; Socket: No; SMD: Yes; Manufacturer1 Example: NIC COMPONENT; Manufacturer1 ComponentHeight: 0.55mm; HelpURL: \\cern.ch\dfs\Applications\Altium\Datasheets\R0603_NIC_NRC.pdf; Author: CERN DEM JLC; CreateDate: 03.12.2007; LatestRevisionDate: 13.03.2008
R10 = R0603_66K5_0.1%_0.063W_10PPM: Resistor - 0.1%; Part Description: Thin Film Chip Resistor; Manufacturer: GENERIC; Manufacturer1 Part Number: RN73C1J66K5BTDF; Power: 0.063W; TC: ±10ppm; PressFit: No; Part Number: R0603_66K5_0.1%_0.063W_10PPM; Component Kind: Standard; Component Type: Standard; Pin Count: 2; Value: 66k5; Status: Not Recommended; Tolerance: ±0.1%; Manufacturer Part Number: R0603_66K5_0.1%_0.063W_10PPM; Case: 0603; Mounted: Yes; Sense: No; Socket: No; SMD: Yes; Manufacturer1 Example: TYCO HOLSWORTHY; Manufacturer1 ComponentHeight: 0.5mm; HelpURL: \\cern.ch\dfs\Applications\Altium\Datasheets\R0603_Tyco_RN73.pdf; Author: CERN DEM JLC; CreateDate: 03.12.2007; LatestRevisionDate: 13.03.2008
R11 = R0603_54K9_0.1%_0.063W_10PPM: Resistor - 0.1%; Part Description: Thin Film Chip Resistor; Manufacturer: GENERIC; Manufacturer1 Part Number: RN73C1J54K9BTDF; Power: 0.063W; TC: ±10ppm; PressFit: No; Part Number: R0603_54K9_0.1%_0.063W_10PPM; Component Kind: Standard; Component Type: Standard; Pin Count: 2; Value: 54k9; Status: Not Recommended; Tolerance: ±0.1%; Manufacturer Part Number: R0603_54K9_0.1%_0.063W_10PPM; Case: 0603; Mounted: Yes; Sense: No; Socket: No; SMD: Yes; Manufacturer1 Example: TYCO HOLSWORTHY; Manufacturer1 ComponentHeight: 0.5mm; HelpURL: \\cern.ch\dfs\Applications\Altium\Datasheets\R0603_Tyco_RN73.pdf; Author: CERN DEM JLC; CreateDate: 03.12.2007; LatestRevisionDate: 13.03.2008
R19 R50 = R0603_NO-VALUE: as R22 on sheet FrontEnd_PS; Part Number: R0603_NO-VALUE; Component Kind: Standard; Component Type: Standard; Pin Count: 2; Value: Undefined; Status: None; Manufacturer: Undefined; Manufacturer Part Number: R0603_NO-VALUE; Case: 0603; Sense: No; Socket: No; SMD: Yes; Manufacturer1 Example: Undefined; Manufacturer1 Part Number: Undefined; Manufacturer1 ComponentHeight: Undefined; HelpURL: Undefined; Author: CERN DEM JLC; CreateDate: 03.12.2007; LatestRevisionDate: 13.03.2008

## Sheet LTM8032_3V8.SchDoc
size A3; DocumentNumber: 10; SheetNumber: 10; SheetTotal: 10
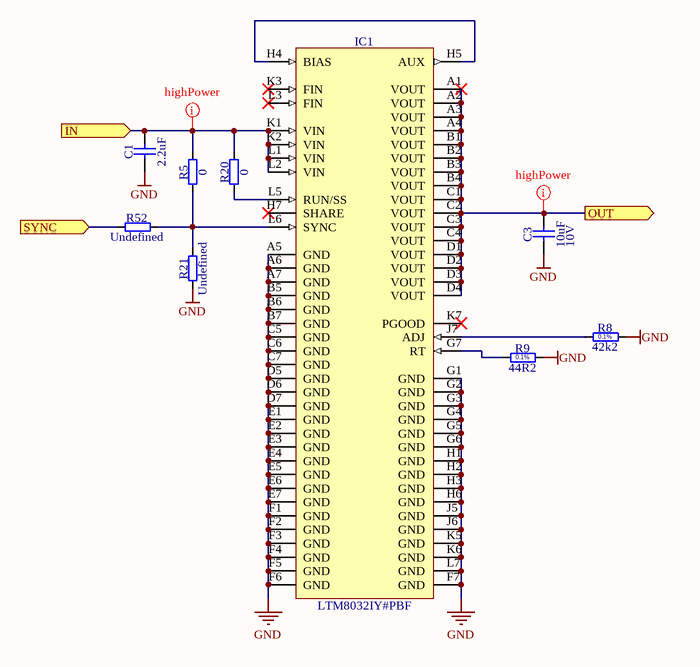
[diagram p3: LTM8032_3V8.SchDoc]

### Parts
C1  2.2uF  [CAPC3216X180N]
C3  10uF  Voltage: 10V  [CAPC2012X135N]
IC1  LTM8032IY#PBF  [BGA71C127P7X11_900X1500X362]
R5  0  [RESC1608X55N]
R8  42k2  [RESC1608X55N]
R9  44R2  [RESC1608X55N]
R20  0  [RESC1608X55N]
R21  Undefined  [RESC1608X55N]
R52  Undefined  [RESC1608X55N]

### Ports
IN (in), OUT (out), SYNC (in)

### Nets
GND: C1.1 C3.1 IC1.A5(GND) IC1.A6(GND) IC1.A7(GND) IC1.B5(GND) IC1.B6(GND) IC1.B7(GND) IC1.C5(GND) IC1.C6(GND) IC1.C7(GND) IC1.D5(GND) IC1.D6(GND) IC1.D7(GND) IC1.E1(GND) IC1.E2(GND) IC1.E3(GND) IC1.E4(GND) IC1.E5(GND) IC1.E6(GND) IC1.E7(GND) IC1.F1(GND) IC1.F2(GND) IC1.F3(GND) IC1.F4(GND) IC1.F5(GND) IC1.F6(GND) IC1.F7(GND) IC1.G1(GND) IC1.G2(GND) IC1.G3(GND) IC1.G4(GND) IC1.G5(GND) IC1.G6(GND) IC1.H1(GND) IC1.H2(GND) IC1.H3(GND) IC1.H6(GND) IC1.J5(GND) IC1.J6(GND) IC1.K5(GND) IC1.K6(GND) IC1.L7(GND) R8.2 R9.2 R21.1
SYNC_DCDC: R52.1 ; port SYNC
NetC1_2: C1.2 IC1.K1(VIN) IC1.K2(VIN) IC1.L1(VIN) IC1.L2(VIN) R5.2 R20.2 ; port IN
NetC3_2: C3.2 IC1.A1(VOUT) IC1.A2(VOUT) IC1.A3(VOUT) IC1.A4(VOUT) IC1.B1(VOUT) IC1.B2(VOUT) IC1.B3(VOUT) IC1.B4(VOUT) IC1.C1(VOUT) IC1.C2(VOUT) IC1.C3(VOUT) IC1.C4(VOUT) IC1.D1(VOUT) IC1.D2(VOUT) IC1.D3(VOUT) IC1.D4(VOUT) ; port OUT
NetIC1_G7: IC1.G7(RT) R9.1
NetIC1_H4: IC1.H4(BIAS) IC1.H5(AUX)
NetIC1_J7: IC1.J7(ADJ) R8.1
NetIC1_L5: IC1.L5(RUN/SS) R20.1
NetIC1_L6: IC1.L6(SYNC) R5.1 R21.2 R52.2

Not connected (* = marked no-connect by the designer): IC1 H7(SHARE)* K3(FIN)* K7(PGOOD)* L3(FIN)*

### Layout directives
net class highPower: NetC1_2, NetC3_2

### Notes on the sheet
- (in symbol R0603_42K2_0.1%_0.063W_10PPM) 0.1%
- (in symbol R0603_44R2_0.1%_0.063W_10PPM) 0.1%

### Library data of the parts
C1 = CC1206_2.2UF_50V_10%_X7R_YUDEN_UMK316B7225KLHT: Non-polarised capacitor; Part Description: SMD Multilayer Chip Ceramic Capacitor (High Dielectric Type) for Automotive / Industrial Applications; Manufacturer: TAIYO YUDEN; Voltage: 50V; TC: X7R; Tolerance: ±10%; Part Number: CC1206_2.2UF_50V_10%_X7R_YUDEN_UMK316B7225KLHT; Component Kind: Standard; Component Type: Standard; Pin Count: 2; Value: 2.2uF; Status: Not Recommended; Manufacturer Part Number: UMK316B7225KLHT; Case: 1206; Mounted: Yes; Socket: No; SMD: Yes; Sense: No; ComponentHeight: 1.9mm; HelpURL: \\cern.ch\dfs\Applications\Altium\Datasheets\CC1206_TAIYO-YUDEN_UMK316B7225KLHT.pdf; Author: CERN DEM JLC; CreateDate: 23.04.2015; LatestRevisionDate: 17.12.2018
C3 = CC0805_10UF_10V_10%_X7R: Non-polarised capacitor; Part Description: SMD Multilayer Chip Ceramic Capacitor; Manufacturer: GENERIC; Manufacturer1 Part Number: GRM21BR71A106KE51L; TC: X7R; Tolerance: ±10%; Part Number: CC0805_10UF_10V_10%_X7R; Component Kind: Standard; Component Type: Standard; Pin Count: 2; Value: 10uF; Status: Preferred; Manufacturer Part Number: CC0805_10UF_10V_10%_X7R; Case: 0805; Mounted: Yes; Socket: No; SMD: Yes; Sense: No; Manufacturer1 Example: MURATA; Manufacturer1 ComponentHeight: 1.35mm; HelpURL: \\cern.ch\dfs\Applications\Altium\Datasheets\CC0805_X7R_MURATA.pdf; Author: CERN DEM JLC; CreateDate: 30.04.2012; LatestRevisionDate: 30.04.2012
IC1 = LTM8032IY#PBF: as IC3 on sheet LTM8032_5V5; Part Number: LTM8032IY#PBF; Component Kind: Standard; Component Type: Standard; Device: LTM8032IY#PBF; PackageDescription: BGA, 1.27mm pitch, rect., 71 pin, 7 columns X 11 rows, 9mm X 15mm X 3.62mm H; Manufacturer Part Number: LTM8032IY#PBF; Pin Count: 71; Case: BGA71; Mounted: Yes; Socket: No; SMD: Yes; Sense: No; ComponentHeight: 3.62mm; HelpURL: \\cern.ch\dfs\Applications\Altium\Datasheets\LTM8032IY#PBF.pdf; Author: CERN DEM BC; CreateDate: 17.12.2018; LatestRevisionDate: 17.12.2018
R5 R20 = R0603_0R_JUMPER: as R92 on sheet FrontEnd_PS; Part Number: R0603_0R_JUMPER; Component Kind: Standard; Component Type: Standard; Pin Count: 2; Value: 0; Status: Preferred; Manufacturer Part Number: R0603_0R_JUMPER; Case: 0603; Mounted: Yes; Sense: No; Socket: No; SMD: Yes; Manufacturer1 Example: NIC COMPONENT; Manufacturer1 ComponentHeight: 0.55mm; HelpURL: \\cern.ch\dfs\Applications\Altium\Datasheets\R0603_NIC_NRC.pdf; Author: CERN DEM JLC; CreateDate: 03.12.2007; LatestRevisionDate: 13.03.2008
R8 = R0603_42K2_0.1%_0.063W_10PPM: Resistor - 0.1%; Part Description: Thin Film Chip Resistor; Manufacturer: GENERIC; Manufacturer1 Part Number: RN73C1J42K2BTDF; Power: 0.063W; TC: ±10ppm; PressFit: No; Part Number: R0603_42K2_0.1%_0.063W_10PPM; Component Kind: Standard; Component Type: Standard; Pin Count: 2; Value: 42k2; Status: Not Recommended; Tolerance: ±0.1%; Manufacturer Part Number: R0603_42K2_0.1%_0.063W_10PPM; Case: 0603; Mounted: Yes; Sense: No; Socket: No; SMD: Yes; Manufacturer1 Example: TYCO HOLSWORTHY; Manufacturer1 ComponentHeight: 0.5mm; HelpURL: \\cern.ch\dfs\Applications\Altium\Datasheets\R0603_Tyco_RN73.pdf; Author: CERN DEM JLC; CreateDate: 03.12.2007; LatestRevisionDate: 13.03.2008
R9 = R0603_44R2_0.1%_0.063W_10PPM: Resistor - 0.1%; Part Description: Thin Film Chip Resistor; Manufacturer: GENERIC; Manufacturer1 Part Number: RN73C1J44R2BTDF; Power: 0.063W; TC: ±10ppm; PressFit: No; Part Number: R0603_44R2_0.1%_0.063W_10PPM; Component Kind: Standard; Component Type: Standard; Pin Count: 2; Value: 44R2; Status: Not Recommended; Tolerance: ±0.1%; Manufacturer Part Number: R0603_44R2_0.1%_0.063W_10PPM; Case: 0603; Mounted: Yes; Sense: No; Socket: No; SMD: Yes; Manufacturer1 Example: TYCO HOLSWORTHY; Manufacturer1 ComponentHeight: 0.5mm; HelpURL: \\cern.ch\dfs\Applications\Altium\Datasheets\R0603_Tyco_RN73.pdf; Author: CERN DEM JLC; CreateDate: 03.12.2007; LatestRevisionDate: 13.03.2008
R21 R52 = R0603_NO-VALUE: as R22 on sheet FrontEnd_PS; Part Number: R0603_NO-VALUE; Component Kind: Standard; Component Type: Standard; Pin Count: 2; Value: Undefined; Status: None; Manufacturer: Undefined; Manufacturer Part Number: R0603_NO-VALUE; Case: 0603; Sense: No; Socket: No; SMD: Yes; Manufacturer1 Example: Undefined; Manufacturer1 Part Number: Undefined; Manufacturer1 ComponentHeight: Undefined; HelpURL: Undefined; Author: CERN DEM JLC; CreateDate: 03.12.2007; LatestRevisionDate: 13.03.2008